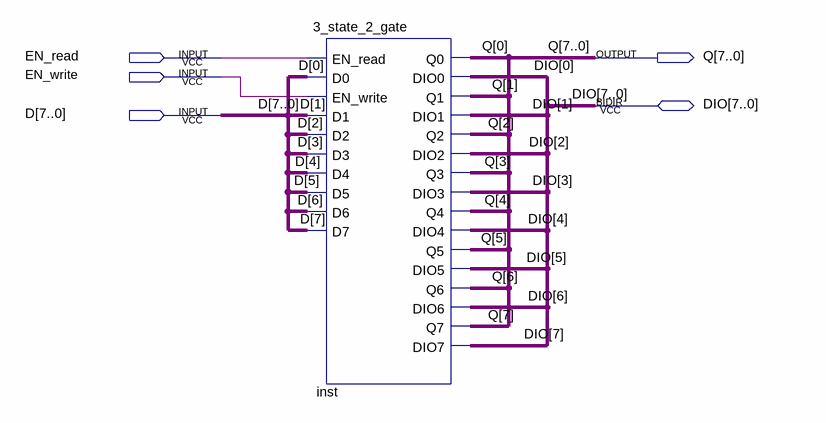
[diagram p0: schematic sheet]
// Quartus schematic 3_state_2_gate_bus.bdf as structural Verilog: 1 symbols, 5 pins
module \3_state_2_gate_bus  (
  input  EN_read,
  input  EN_write,
  input  [7:0] D,
  inout  [7:0] DIO,
  output [7:0] Q
);

  \3_state_2_gate  inst (
    .EN_read(EN_read), .D0(D[0]), .EN_write(EN_write), .D1(D[1]), .D2(D[2]), .D3(D[3]), .D4(D[4]), .D5(D[5]),
    .D6(D[6]), .D7(D[7]), .Q0(Q[0]), .Q1(Q[1]), .Q2(Q[2]), .Q3(Q[3]), .Q4(Q[4]), .Q5(Q[5]), .Q6(Q[6]),
    .Q7(Q[7]), .DIO0(DIO[0]), .DIO1(DIO[1]), .DIO2(DIO[2]), .DIO3(DIO[3]), .DIO4(DIO[4]), .DIO5(DIO[5]),
    .DIO6(DIO[6]), .DIO7(DIO[7]));
endmodule
